# Altium project BioZ_RevA.PrjPcb
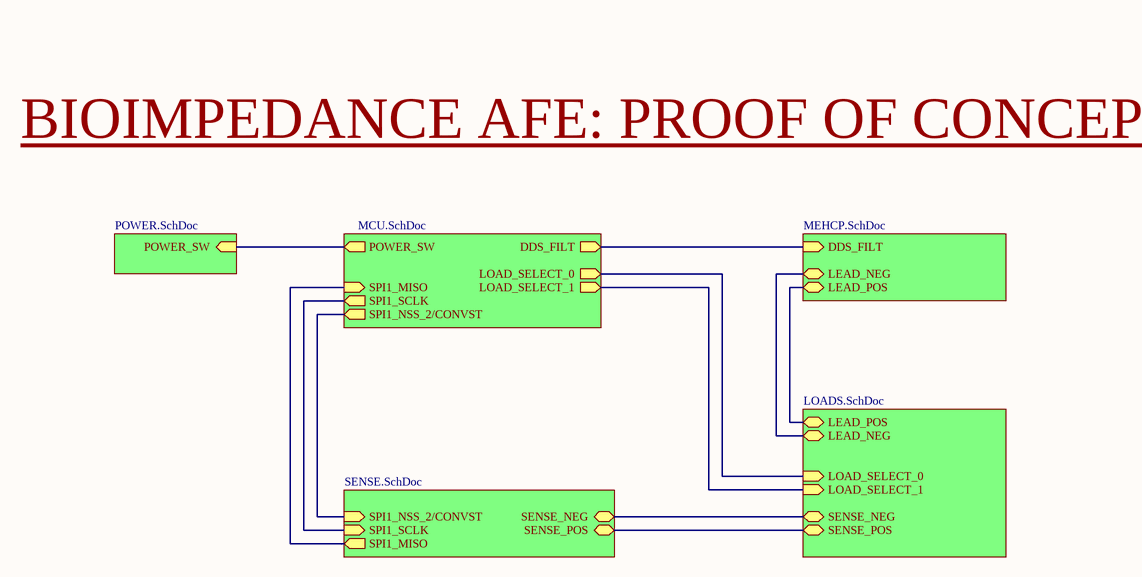
[diagram p0: BLOCK DIAGRAM.SchDoc]
6 sheets, 174 parts. Net scope: hierarchical (ports join the sheet entries above them; power ports are global).
Board file: BioZ.PcbDoc
Sheets:
  BLOCK DIAGRAM.SchDoc
    U_LOADS = LOADS.SchDoc
    U_MCU = MCU.SchDoc
    U_MEHCP = MEHCP.SchDoc
    U_POWER = POWER.SchDoc
    U_SENSE = SENSE.SchDoc

## Sheet BLOCK DIAGRAM.SchDoc: BLOCK DIAGRAM
size A4; DrawnBy: Lucas Church; DocumentNumber: N/A; Revision: A; SheetNumber: 1; SheetTotal: 6

### Sub-sheets
U_LOADS = LOADS.SchDoc: LOAD_SELECT_1 (in), LOAD_SELECT_0 (in), SENSE_NEG (bidir), SENSE_POS (bidir), LEAD_NEG (bidir), LEAD_POS (bidir)
U_MCU = MCU.SchDoc: SPI1_SCLK (out), SPI1_MISO (in), LOAD_SELECT_1 (out), LOAD_SELECT_0 (out), SPI1_NSS_2/CONVST (out), DDS_FILT (out), POWER_SW (out)
U_MEHCP = MEHCP.SchDoc: DDS_FILT (in), LEAD_NEG (bidir), LEAD_POS (bidir)
U_POWER = POWER.SchDoc: POWER_SW (in)
U_SENSE = SENSE.SchDoc: SPI1_SCLK (in), SPI1_NSS_2/CONVST (in), SPI1_MISO (out), SENSE_NEG (bidir), SENSE_POS (bidir)

### Nets
SPI1_SCK: sheet U_MCU/SPI1_SCLK, sheet U_SENSE/SPI1_SCLK
NetC17_2: sheet U_LOADS/LEAD_NEG, sheet U_MEHCP/LEAD_NEG
NetC18_2: sheet U_LOADS/LEAD_POS, sheet U_MEHCP/LEAD_POS
NetD2_1: sheet U_LOADS/SENSE_POS, sheet U_SENSE/SENSE_POS
NetD2_2: sheet U_LOADS/SENSE_NEG, sheet U_SENSE/SENSE_NEG
NetJP5_1: sheet U_LOADS/LOAD_SELECT_0, sheet U_MCU/LOAD_SELECT_0
NetJP7_1: sheet U_LOADS/LOAD_SELECT_1, sheet U_MCU/LOAD_SELECT_1
NetR5_2: sheet U_MCU/DDS_FILT, sheet U_MEHCP/DDS_FILT
NetR44_2: sheet U_MCU/POWER_SW, sheet U_POWER/POWER_SW
NetU1_26: sheet U_MCU/SPI1_NSS_2/CONVST, sheet U_SENSE/SPI1_NSS_2/CONVST
NetU1_28: sheet U_MCU/SPI1_MISO, sheet U_SENSE/SPI1_MISO

### Notes on the sheet
- BIOIMPEDANCE AFE: PROOF OF CONCEPT

## Sheet LOADS.SchDoc
size A4; SheetNumber: 4; SheetTotal: 6
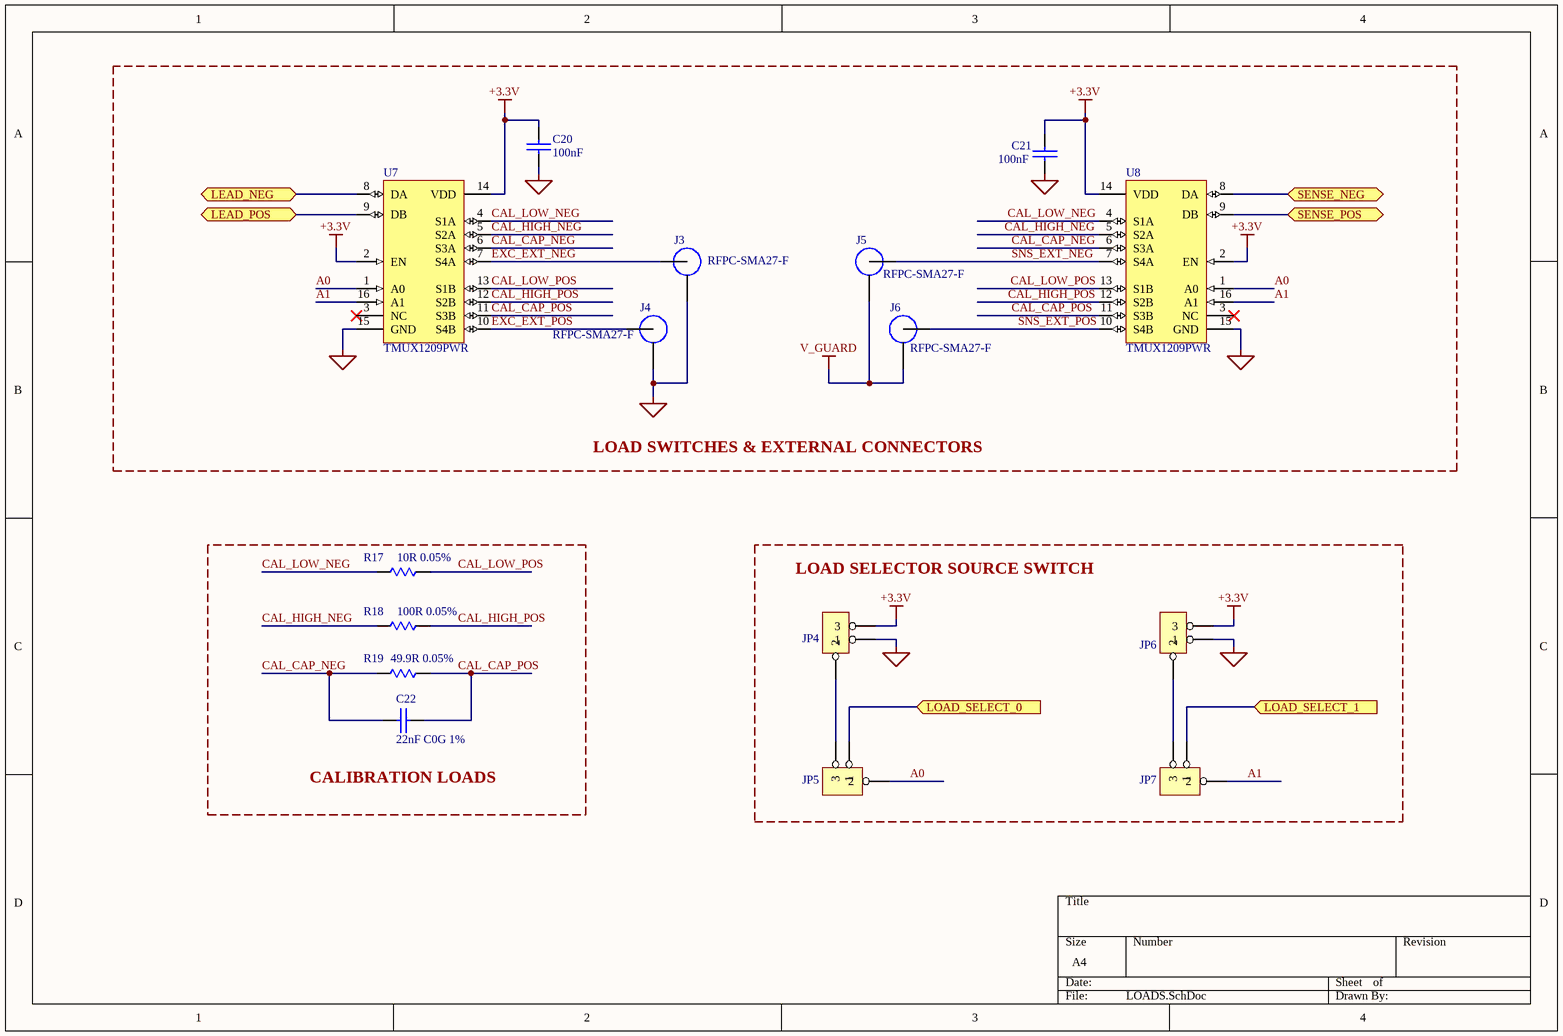
[diagram p1: LOADS.SchDoc]

### Parts
C20  100nF  [0603-CAP]
C21  100nF  [0603-CAP]
C22  22nF C0G 1%  [0805-CAP]
J3  RFPC-SMA27-F  [GRADCONN_RFPC-SMA27-F]
J4  RFPC-SMA27-F  [GRADCONN_RFPC-SMA27-F]
J5  RFPC-SMA27-F  [GRADCONN_RFPC-SMA27-F]
J6  RFPC-SMA27-F  [GRADCONN_RFPC-SMA27-F]
JP4  JUMPER1X3  [JUMPER3]  (value not drawn)
JP5  JUMPER1X3  [JUMPER3]  (value not drawn)
JP6  JUMPER1X3  [JUMPER3]  (value not drawn)
JP7  JUMPER1X3  [JUMPER3]  (value not drawn)
R17  10R 0.05%  [0603-RES]
R18  100R 0.05%  [0603-RES]
R19  49.9R 0.05%  [0603-RES]
U7  TMUX1209PWR  [PW0016A_N]
U8  TMUX1209PWR  [PW0016A_N]

### Blocks framed on the sheet
LOAD SWITCHES & EXTERNAL CONNECTORS: C20 C21 J3-J6 U7 U8
CALIBRATION LOADS: C22 R17-R19
LOAD SELECTOR SOURCE SWITCH: JP4-JP7

### Ports
LEAD_NEG (bidir, see BLOCK DIAGRAM[3C], MEHCP[4B]), LEAD_POS (bidir, see BLOCK DIAGRAM[3C], MEHCP[4C]), LOAD_SELECT_0 (in, see BLOCK DIAGRAM[3C], MCU[3A]), LOAD_SELECT_1 (in, see BLOCK DIAGRAM[3C], MCU[3A]), SENSE_NEG (bidir, see BLOCK DIAGRAM[3C], SENSE[1B]), SENSE_POS (bidir, see BLOCK DIAGRAM[3C], SENSE[1B])

### Nets
+3.3V: C20.1 C21.1 JP4.3 JP6.3 U7.2(EN) U7.14(VDD) U8.2(EN) U8.14(VDD)
GND: C20.2 C21.2 J3.SHLD J4.SHLD JP4.1 JP6.1 U7.15(GND) U8.15(GND)
V_GUARD: J5.SHLD J6.SHLD
A0: JP5.2 U7.1(A0) U8.1(A0)
A1: JP7.2 U7.16(A1) U8.16(A1)
CAL_CAP_NEG: C22.1 R19.1 U7.6(S3A) U8.6(S3A)
CAL_CAP_POS: C22.2 R19.2 U7.11(S3B) U8.11(S3B)
CAL_HIGH_NEG: R18.1 U7.5(S2A) U8.5(S2A)
CAL_HIGH_POS: R18.2 U7.12(S2B) U8.12(S2B)
CAL_LOW_NEG: R17.1 U7.4(S1A) U8.4(S1A)
CAL_LOW_POS: R17.2 U7.13(S1B) U8.13(S1B)
EXC_EXT_NEG: J3.SIG U7.7(S4A)
EXC_EXT_POS: J4.SIG U7.10(S4B)
SNS_EXT_NEG: J5.SIG U8.7(S4A)
SNS_EXT_POS: J6.SIG U8.10(S4B)
NetC17_2: U7.8(DA) ; port LEAD_NEG
NetC18_2: U7.9(DB) ; port LEAD_POS
NetD2_1: U8.9(DB) ; port SENSE_POS
NetD2_2: U8.8(DA) ; port SENSE_NEG
NetJP4_2: JP4.2 JP5.3
NetJP5_1: JP5.1 ; port LOAD_SELECT_0
NetJP6_2: JP6.2 JP7.3
NetJP7_1: JP7.1 ; port LOAD_SELECT_1

Not connected (* = marked no-connect by the designer): U7 3(NC)*; U8 3(NC)*

### Library data of the parts
C20 C21 = CGA3E2C0G1H472J080AA: CAP CER 100 NF 50V X7R 0603; Manufacturer Part Number 1: CC0603KRX7R9BB104; Manufacturer 1: YAGEO; Tech#: SMT; Detailed Description: CAP CER 100 NF 50V X7R 0603; Supplier 1: DigiKey; Supplier Part Number 1: 311-1344-1-ND; Supplier 2: Mouser; Supplier Part Number 2: 810-CGA3E2C0G1H472J; Price(100): 0.1434; Price(250): 0.10756
C22 = GCM21B5C1H223JA16L: CAP CER 0.022UF 50V C0G/NP0 0805; Manufacturer Part Number 1: GCM21B5C1H223FA16L; Manufacturer 1: Murata; Tech#: SMT; Detailed Description: CAP CER 0.022UF 50V C0G/NP0 0805; Supplier 1: DigiKey; Supplier Part Number 1: 490-GCM21B5C1H223FA16LCT-ND; Supplier 2: Mouser; Supplier Part Number 2: 81-GCM21B5C1H223JA6L; Price(100): 0.1789
J3-J6 = RFPC-SMA27-F: MF: {'manufacturer': u'GCT (Gradconn)'}; Package: None; Price: None; Value: *; MP: RFPC-SMA27-F; Availability: Unavailable
JP4-JP7 = 68001-203HLF: CONN HEADER VERT 36POS 2.54MM; Manufacturer 1: FCI; Detailed Description: Jumper, 1x3 Vertical T/H 0.1in; Location: #N/A; Notes: Can be 68001-236HLF cut to length; Tech#: T/H; Manufacturer Part Number 1: 68001-203HLF; Supplier 1: DigiKey; Supplier Part Number 1: 609-3470-ND; Supplier 2: Mouser; Supplier Part Number 2: 649-68001-203HLF; Price(1): 0.43; Price(10): 0.32; Price(25): 0.32; Price(100): 0.2436
R17 = 4.99K 0603: RES SMD 10OHM 0.05% 1/10W 0603; Manufacturer Part Number 1: RNCF0603AKT10R0; Manufacturer 1: Stackpole Electronics; Tech#: SMT; Detailed Description: RES SMD 10OHM 0.05% 1/10W 0603; Supplier 1: DigiKey; Supplier Part Number 1: RNCF0603AKT10R0CT-ND; Supplier 2: Mouser; Supplier Part Number 2: 754-RR0816P-4991D68H; Price(100): 0.023
R18 = 4.99K 0603: RES SMD 100OHM 0.05% 1/10W 0603; Manufacturer Part Number 1: RG1608N-101-W-T1; Manufacturer 1: Susumu; Tech#: SMT; Detailed Description: RES SMD 100OHM 0.05% 1/10W 0603; Supplier 1: DigiKey; Supplier Part Number 1: RG16N100WCT-ND; Supplier 2: Mouser; Supplier Part Number 2: 754-RR0816P-4991D68H; Price(100): 0.023
R19 = 4.99K 0603: RES SMD 49.9OHM 0.05% 1/10W 0603; Manufacturer Part Number 1: RG1608N-49R9-W-T1; Manufacturer 1: Susumu; Detailed Description: RES SMD 49.9OHM 0.1% 1/10W 0603; Tech#: SMT; Supplier 1: DigiKey; Supplier Part Number 1: 408-RG1608N-49R9-W-T1CT-ND; Supplier 2: Mouser; Supplier Part Number 2: 754-RR0816P-4991D68H; Price(100): 0.023
U7 U8 = TMUX1209PWR: 5-V, 4:1, 2-channel general-purpose multiplexer with 1.8-V input logic control 16-TSSOP -40 to 125; Manufacturer_Name: Texas Instruments; TYPE: TYPE; RefDes: RefDes; Copyright: Copyright (C) 2025 Ultra Librarian. All rights reserved.; Manufacturer_Part_Number: TMUX1209PWR

## Sheet MCU.SchDoc
size A4; SheetNumber: 2; SheetTotal: 6
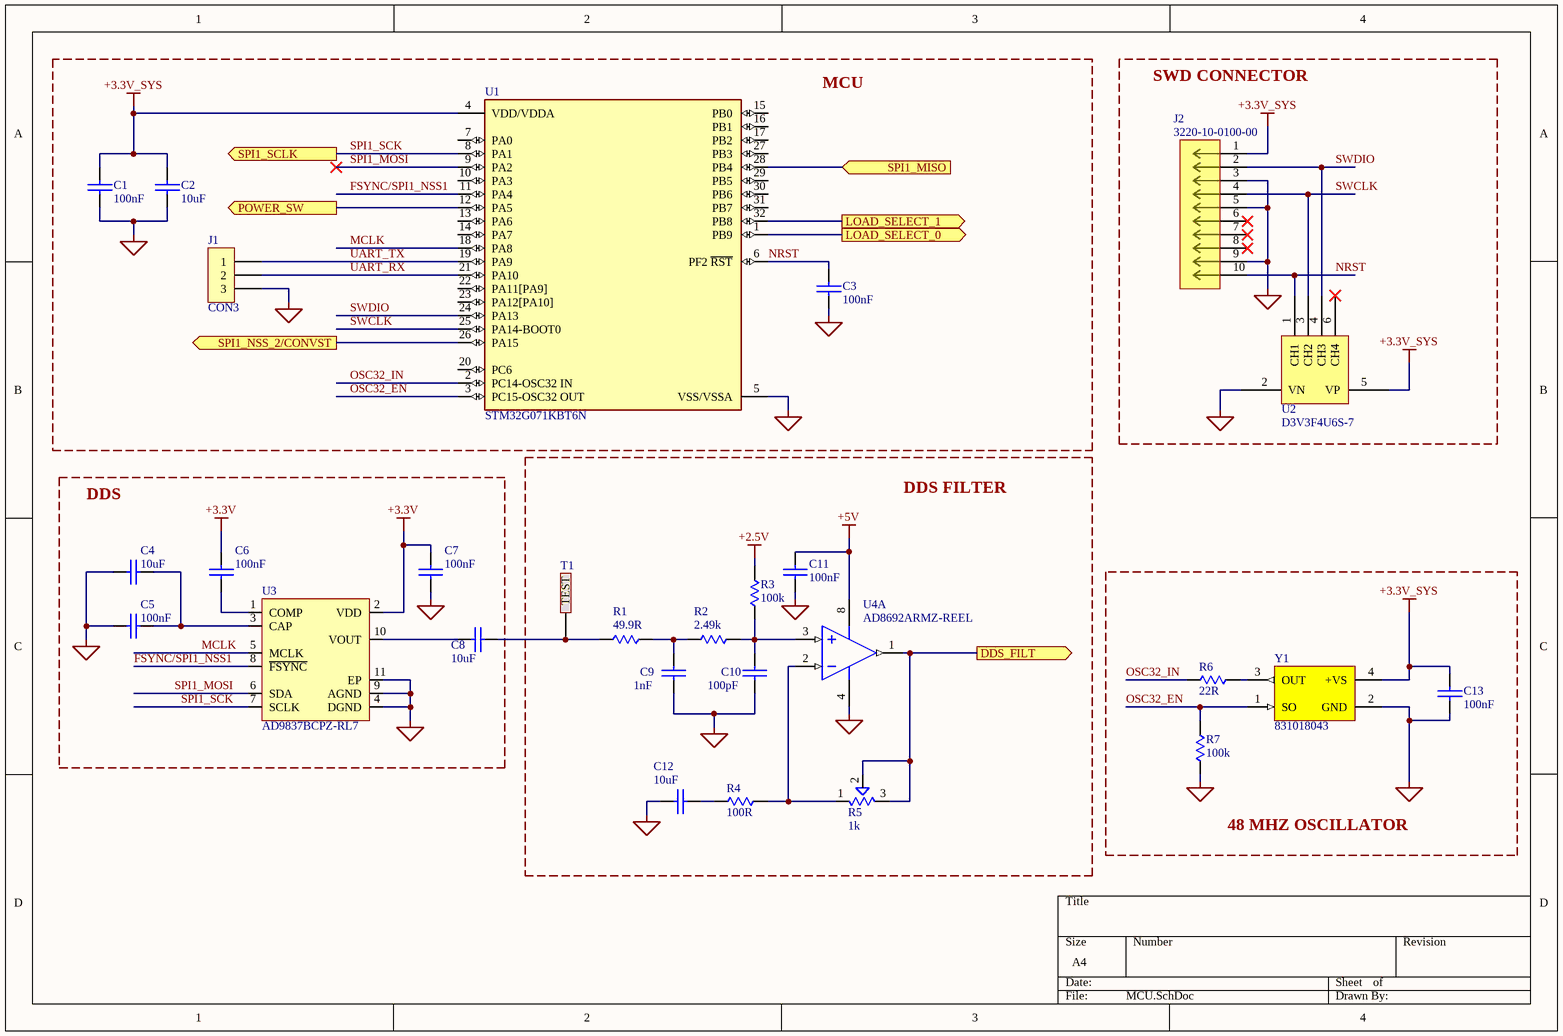
[diagram p2: MCU.SchDoc]

### Parts
C1  100nF  [0603-CAP]
C2  10uF  [0603-CAP]
C3  100nF  [0603-CAP]
C4  10uF  [0603-CAP]
C5  100nF  [0603-CAP]
C6  100nF  [0603-CAP]
C7  100nF  [0603-CAP]
C8  10uF  [0603-CAP]
C9  1nF  [0603-CAP]
C10  100pF  [0603-CAP]
C11  100nF  [0603-CAP]
C12  10uF  [0603-CAP]
C13  100nF  [0603-CAP]
J1  CON3  [SIP3]
J2  3220-10-0100-00  [CONN_3220-10-0100-00_CNC]
R1  49.9R  [0603-RES]
R2  2.49k  [0603-RES]
R3  100k  [0603-RES]
R4  100R  [0603-RES]
R5  1k  [TRIM_PVG5A102C03R00]
R6  22R  [0603-RES]
R7  100k  [0603-RES]
T1  5002K  [TESTPOINT White]  (value not drawn)
U1  STM32G071KBT6N  [FP-LQFP32-5V-IPC_C]
U2  D3V3F4U6S-7  [SOT-363_DIO]
U3  AD9837BCPZ-RL7  [LFCSP-WD (3x3) - 10 Pin EPAD]
U4  AD8692ARMZ-REEL  [ADI-RM-8_M]  (part A of 2)
Y1  831018043  [WE-SPXO_CFPS-73]

### Blocks framed on the sheet
MCU: C1-C3 J1 U1
SWD CONNECTOR: J2 U2
DDS FILTER: C9-C12 R1-R5 T1 U4
DDS: C4-C8 U3
48 MHZ OSCILLATOR: C13 R6 R7 Y1

### Ports
DDS_FILT (out, see BLOCK DIAGRAM[2B], MEHCP[1A]), LOAD_SELECT_0 (out, see BLOCK DIAGRAM[2B], LOADS[3C]), LOAD_SELECT_1 (out, see BLOCK DIAGRAM[2B], LOADS[4C]), POWER_SW (out, see BLOCK DIAGRAM[2B], POWER[3C]), SPI1_MISO (in, see BLOCK DIAGRAM[2B], SENSE[3D]), SPI1_NSS_2/CONVST (out, see BLOCK DIAGRAM[2B], SENSE[3D]), SPI1_SCLK (out, see BLOCK DIAGRAM[2B], SENSE[3D])

### Nets
+2.5V: R3.2
+3.3V: C6.1 C7.1 U3.2(VDD)
+3.3V_SYS: C1.2 C2.1 C13.2 J2.1 U1.4(VDD/VDDA) U2.5(VP) Y1.4(+VS)
+5V: C11.1 U4.8(+V)
GND: C1.1 C2.2 C3.1 C4.2 C5.2 C7.2 C9.2 C10.2 C11.2 C12.2 C13.1 J1.3 J2.3 J2.5 J2.9 R7.1 U1.5(VSS/VSSA) U2.2(VN) U3.4(DGND) U3.9(AGND) U3.11(EP) U4.4(-V) Y1.2(GND)
FSYNC/SPI1_NSS1: U1.11(PA4) U3.8(~{FSYNC})
MCLK: U1.18(PA8) U3.5(MCLK)
NRST: C3.2 J2.10 U1.6(PF2_~{RST}) U2.1(CH1)
OSC32_EN: R7.2 U1.3(PC15-OSC32_OUT) Y1.1(SO)
OSC32_IN: R6.1 U1.2(PC14-OSC32_IN)
SPI1_MOSI: U1.9(PA2) U3.6(SDA)
SPI1_SCK: U1.8(PA1) U3.7(SCLK) ; port SPI1_SCLK
SWCLK: J2.4 U1.25(PA14-BOOT0) U2.3(CH2)
SWDIO: J2.2 U1.24(PA13) U2.4(CH3)
UART_RX: J1.2 U1.21(PA10)
UART_TX: J1.1 U1.19(PA9)
NetC4_1: C4.1 C5.1 U3.3(CAP)
NetC6_2: C6.2 U3.1(COMP)
NetC8_1: C8.1 R1.1 T1.1(TEST)
NetC8_2: C8.2 U3.10(VOUT)
NetC9_1: C9.1 R1.2 R2.1
NetC10_1: C10.1 R2.2 R3.1 U4.3(+IN_A)
NetC12_1: C12.1 R4.1
NetJP5_1: U1.1(PB9) ; port LOAD_SELECT_0
NetJP7_1: U1.32(PB8) ; port LOAD_SELECT_1
NetR4_2: R4.2 R5.1 U4.2(-IN_A)
NetR5_2: R5.2 R5.3 U4.1(OUT_A) ; port DDS_FILT
NetR6_2: R6.2 Y1.3(OUT)
NetR44_2: U1.12(PA5) ; port POWER_SW
NetU1_26: U1.26(PA15) ; port SPI1_NSS_2/CONVST
NetU1_28: U1.28(PB4) ; port SPI1_MISO

Not connected (* = marked no-connect by the designer): J2 6* 7* 8*; U1 7(PA0) 10(PA3) 13(PA6) 14(PA7) 15(PB0) 16(PB1) 17(PB2) 20(PC6) 22(PA11[PA9]) 23(PA12[PA10]) 27(PB3) 29(PB5) 30(PB6) 31(PB7); U2 6(CH4)*

### Library data of the parts
C1 C3 C5-C7 C11 C13 = CGA3E2C0G1H472J080AA: as C20 on sheet LOADS; Detailed Description: CAP CER 100 NF 50V X7R 0603; Supplier 1: DigiKey; Supplier Part Number 1: 311-1344-1-ND; Supplier 2: Mouser; Supplier Part Number 2: 810-CGA3E2C0G1H472J; Price(100): 0.1434; Price(250): 0.10756
C2 C4 C8 C12 = CGA3E2C0G1H472J080AA: CAP CER 10uF 6.3V X5R 0603; Manufacturer Part Number 1: GRM188R60J106KE47D; Manufacturer 1: Murata Electronics; Detailed Description: CAP CER 100 NF 50V X7R 0603; Tech#: SMT; Supplier 1: DigiKey; Supplier Part Number 1: 490-12538-1-ND; Supplier 2: Mouser; Supplier Part Number 2: 810-CGA3E2C0G1H472J; Price(100): 0.1434; Price(250): 0.10756
C9 = CGA3E2C0G1H472J080AA: CAP CER 1000 PF 50V C0G 0603; Manufacturer Part Number 1: GRM1885C1H102JA01D; Manufacturer 1: Murata; Detailed Description: CAP CER 100 NF 50V X7R 0603; Tech#: SMT; Supplier 1: DigiKey; Supplier Part Number 1: 490-1451-1-ND; Supplier 2: Mouser; Supplier Part Number 2: 810-CGA3E2C0G1H472J; Price(100): 0.1434; Price(250): 0.10756
C10 = CGA3E2C0G1H472J080AA: CAP CER 100 PF 50V C0G 0603; Manufacturer Part Number 1: CC0603JRNPO9BN101; Manufacturer 1: YAGEO; Tech#: SMT; Detailed Description: CAP CER 100 PF 50V C0G 0603; Supplier 1: DigiKey; Supplier Part Number 1: 311-1069-1-ND; Supplier 2: Mouser; Supplier Part Number 2: 810-CGA3E2C0G1H472J; Price(100): 0.1434; Price(250): 0.10756
J1 = CON3: Connector
J2 = 3220-10-0100-00: Description; Manufacturer_Name: CNC Tech; Copyright: Copyright (C) 2025 Ultra Librarian. All rights reserved.; Manufacturer_Part_Number: 3220-10-0100-00; RefDes: RefDes; Type: Type
R1 = 4.99K 0603: RES SMD 49.9OHM 0.1% 1/10W 0603; Manufacturer Part Number 1: RT0603BRD0749R9L; Manufacturer 1: Yageo; Tech#: SMT; Detailed Description: RES SMD 49.9OHM 0.1% 1/10W 0603; Supplier 1: DigiKey; Supplier Part Number 1: YAG1672CT-ND; Supplier 2: Mouser; Supplier Part Number 2: 754-RR0816P-4991D68H; Price(100): 0.023
R2 = 4.99K 0603: RES SMD 2.49kOHM 0.1% 1/10W 0603; Manufacturer Part Number 1: ERA-3AEB2491V; Manufacturer 1: Panasonic; Tech#: SMT; Detailed Description: RES SMD 2.49kOHM 0.1% 1/10W 0603; Supplier 1: DigiKey; Supplier Part Number 1: RES SMD 2.49KOHM 0.1% 1/10W 0603; Supplier 2: Mouser; Supplier Part Number 2: 754-RR0816P-4991D68H; Price(100): 0.023
R3 R7 = 4.99K 0603: RES SMD 100KOHM 0.1% 1/10W 0603; Manufacturer Part Number 1: RT0603BRD07100KL; Manufacturer 1: YAGEO; Detailed Description: RES SMD 4.99KOHM 0.5% 1/16W 0603; Tech#: SMT; Supplier 1: DigiKey; Supplier Part Number 1: YAG1235CT-ND; Supplier 2: Mouser; Supplier Part Number 2: 754-RR0816P-4991D68H; Price(100): 0.023
R4 = 4.99K 0603: RES SMD 100OHM 0.1% 1/10W 0603; Manufacturer Part Number 1: RG1608P-101-B-T5; Manufacturer 1: Susumu; Detailed Description: RES SMD 4.99KOHM 0.5% 1/16W 0603; Tech#: SMT; Supplier 1: DigiKey; Supplier Part Number 1: RR08P4.99KDCT-ND; Supplier 2: Mouser; Supplier Part Number 2: 754-RR0816P-4991D68H; Price(100): 0.023
R5 = PVG5A102C03R00: TRIMMER-SMD 4MM SQ MT CERMET Square / 12 turn / Sealed | Bourns PVG5A102C03R00; SnapEDA_Link: https://www.snapeda.com/parts/PVG5A102C03R00/Bourns/view-part/?ref=snap; Package: SMD-3 Bourns; Value: *; MF: Bourns; MP: PVG5A102C03R00; Check_prices: https://www.snapeda.com/parts/PVG5A102C03R00/Bourns/view-part/?ref=eda
R6 = 4.99K 0603: RES SMD 22OHM 0.1% 1/10W 0603; Manufacturer Part Number 1: RT0603BRD0722RL; Manufacturer 1: YAGEO; Tech#: SMT; Detailed Description: RES SMD 22OHM 0.1% 1/10W 0603; Supplier 1: DigiKey; Supplier Part Number 1: 13-RT0603BRD0722RLCT-ND; Supplier 2: Mouser; Supplier Part Number 2: 754-RR0816P-4991D68H; Price(100): 0.023
T1 = 5002K: PC TEST POINT MINIATURE WHITE; Manufacturer 1: Keystone Electronics; Detailed Description: Connector, TestPoint White; Location: F1-33; Tech#: T/H; Manufacturer Part Number 1: 5002K; Supplier 1: DigiKey; Supplier Part Number 1: 36-5002-ND; Supplier 2: Mouser; Supplier Part Number 2: 534-5002; Price(1): 0.56; Price(10): 0.506; Price(100): 0.3541
U1 = CMP-12105-000115-1: IC MCU 32BIT 128KB FLASH 32LQFP; Core Architecture: ARM; Frequency: 64MHz; Number of I/Os: 30; Interface: I2C; Oscillator Type: Internal; Peripherals: Brown-out Detect/Reset; Number of Pins: 32; Max Operating Temperature: 85°C; RoHS Compliant: Yes; Packaging: Cut Tape; Case/Package: LQFP; Memory Type: FLASH; Memory Size: 128KB; Min Operating Temperature: -40°C
U2 = D3V3F4U6S-7: Description; Manufacturer_Name: Diodes Inc; Copyright: Copyright (C) 2025 Ultra Librarian. All rights reserved.; Manufacturer_Part_Number: D3V3F4U6S-7; RefDes: RefDes; Type: Type
U3 = AD9837BCPZ-RL7: Direct Digital Synthesis IC 10 b 16 MHz 28 b Tuning 10-LFCSP-WD (3x3)
U4 = CMP-0384-01747-1: Double Channel Wide Bandwidth Operational Amplifier, 10 MHz BW, 5 V/us SR, Industrial, 8-pin SOP (RM-8), Reel; Manufacturer: Analog Devices; Generic Part Number: AD8692; Slew Rate: 5V/us; Automotive Qualified: Yes; V Span Max: 6V; V Span Min: 2.7V; Input Bias Current: 200fA; Amplifiers Per Package: 2; Iq/Amp: 1.05mA; Input Offset Voltage: 400uV; Small Signal Bandwidth: 10MHz; ComponentLink1Description: Manufacturer URL; ComponentLink1URL: http://www.analog.com/en/index.html; Mounting Technology: Surface Mount; PackageDescription: 8-Pin Mini Small Outline Package, Body 3 x 3 mm, Pitch 0.65 mm; PackageReference: RM-8; DatasheetVersion: Rev. E; PartNumber: AD8692ARMZ-REEL; ComponentLink2Description: Datasheet; ComponentLink3Description: Package Specification; ComponentLink2URL: http://www.analog.com/static/imported-files/data_sheets/AD8691_8692_8694.pdf; ComponentLink3URL: http://www.analog.com/static/imported-files/packages/PKG_PDF/MSOP%28RM%29/RM_8.pdf; Code_JEDEC: MO-187-AA
Y1 = WE-SPXO_CFPS-73: MF: {'manufacturer': u'W\xfcrth Elektronik'}; Package: None; Price: None; Value: *; MP: 831018043; Availability: Unavailable

## Sheet MEHCP.SchDoc
size A4; SheetNumber: 3; SheetTotal: 6
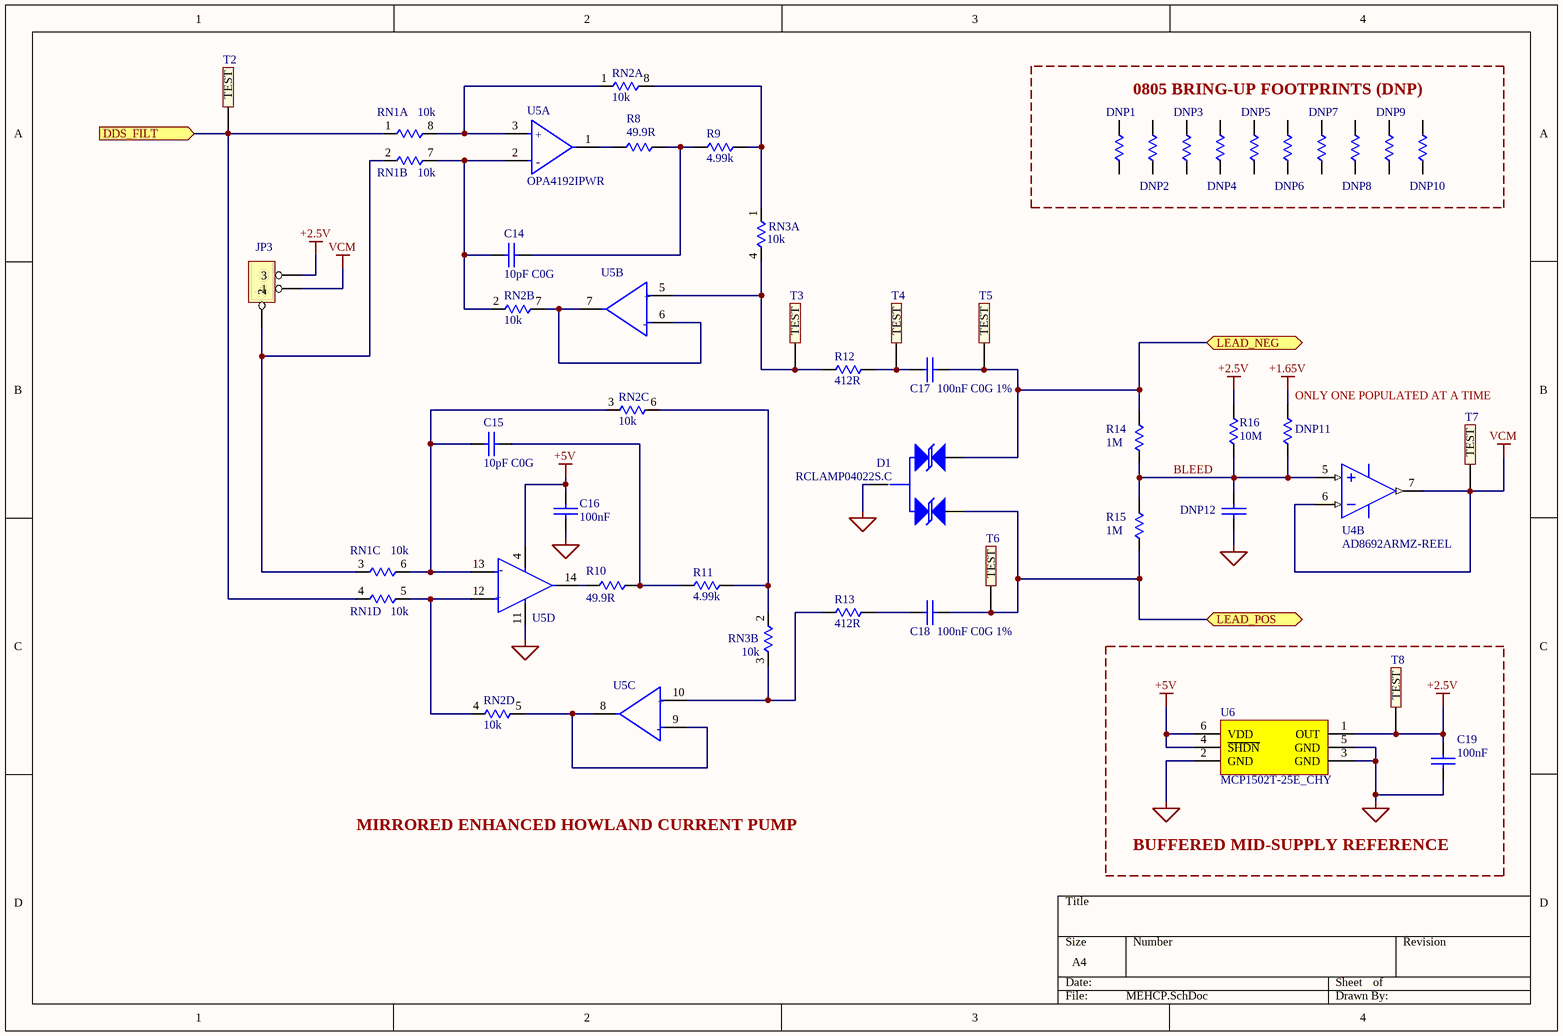
[diagram p3: MEHCP.SchDoc]

### Parts
C14  10pF C0G  [0603-CAP]
C15  10pF C0G  [0603-CAP]
C16  100nF  [0603-CAP]
C17  100nF C0G 1%  [1206-CAP]
C18  100nF C0G 1%  [1206-CAP]
C19  100nF  [0603-CAP]
D1  RCLAMP04022S.C  [SOT-23 3L]
DNP1  240R 0.1%  [0805-RES]  (value not drawn)  (no BOM)
DNP2  240R 0.1%  [0805-RES]  (value not drawn)  (no BOM)
DNP3  240R 0.1%  [0805-RES]  (value not drawn)  (no BOM)
DNP4  240R 0.1%  [0805-RES]  (value not drawn)  (no BOM)
DNP5  240R 0.1%  [0805-RES]  (value not drawn)  (no BOM)
DNP6  240R 0.1%  [0805-RES]  (value not drawn)  (no BOM)
DNP7  240R 0.1%  [0805-RES]  (value not drawn)  (no BOM)
DNP8  240R 0.1%  [0805-RES]  (value not drawn)  (no BOM)
DNP9  240R 0.1%  [0805-RES]  (value not drawn)  (no BOM)
DNP10  240R 0.1%  [0805-RES]  (value not drawn)  (no BOM)
DNP11  10M  [0603-RES]  (value not drawn)  (no BOM)
DNP12  4.7nF C0G  [0603-CAP]  (value not drawn)  (no BOM)
JP3  JUMPER1X3  [JUMPER3]  (value not drawn)
R8  49.9R  [0603-RES]
R9  4.99k  [0603-RES]
R10  49.9R  [0603-RES]
R11  4.99k  [0603-RES]
R12  412R  [0603-RES]
R13  412R  [0603-RES]
R14  1M  [0603-RES]
R15  1M  [0603-RES]
R16  10M  [0603-RES]
RN1  10k  [1206 4-Resistor Network]  (parts A,B,C,D of 4)
RN2  10k  [1206 4-Resistor Network]  (parts A,B,C,D of 4)
RN3  10k  [0606 2-RESISTOR NETWORK]  (parts A,B of 2)
T2  5002K  [TESTPOINT White]  (value not drawn)
T3  5002K  [TESTPOINT White]  (value not drawn)
T4  5002K  [TESTPOINT White]  (value not drawn)
T5  5002K  [TESTPOINT White]  (value not drawn)
T6  5002K  [TESTPOINT White]  (value not drawn)
T7  5002K  [TESTPOINT White]  (value not drawn)
T8  5002K  [TESTPOINT White]  (value not drawn)
U4  AD8692ARMZ-REEL  [ADI-RM-8_M]  (part B of 2)
U5  OPA4192IPWR  [FP-PW0014A-IPC_C]  (parts A,B,C,D of 4)
U6  MCP1502T-25E_CHY  [SOT95P280X145-6N]

### Blocks framed on the sheet
0805 BRING-UP FOOTPRINTS (DNP): DNP1-DNP10
BUFFERED MID-SUPPLY REFERENCE: C19 T8 U6

### Ports
DDS_FILT (in, see BLOCK DIAGRAM[3B], MCU[3C]), LEAD_NEG (bidir, see BLOCK DIAGRAM[3B], LOADS[1A]), LEAD_POS (bidir, see BLOCK DIAGRAM[3B], LOADS[1A])

### Nets
+1.65V: DNP11.2
+2.5V: C19.1 JP3.3 R16.2 T8.1(TEST) U6.1(OUT)
+5V: C16.1 U5.4(V+) U6.4(~{SHDN}) U6.6(VDD)
GND: C16.2 C19.2 D1.3 DNP12.1 U5.11(V-) U6.2(GND) U6.3(GND) U6.5(GND)
VCM: JP3.1 T7.1(TEST) U4.6(-IN_B) U4.7(OUT_B)
BLEED: DNP11.1 DNP12.2 R14.1 R15.2 R16.1 U4.5(+IN_B)
NetC14_1: C14.1 RN1.7 RN2.2 U5.2(-IN_A)
NetC14_2: C14.2 R8.2 R9.1
NetC15_1: C15.1 RN1.6 RN2.3 U5.13(-IN_D)
NetC15_2: C15.2 R10.2 R11.1
NetC17_1: C17.1 R12.2 T4.1(TEST)
NetC17_2: C17.2 D1.2 R14.2 T5.1(TEST) ; port LEAD_NEG
NetC18_1: C18.1 R13.2
NetC18_2: C18.2 D1.1 R15.1 T6.1(TEST) ; port LEAD_POS
NetJP3_2: JP3.2 RN1.2 RN1.3
NetR5_2: RN1.1 RN1.4 T2.1(TEST) ; port DDS_FILT
NetR8_1: R8.1 U5.1(OUT_A)
NetR9_2: R9.2 RN2.8 RN3.1
NetR10_1: R10.1 U5.14(OUT_D)
NetR11_2: R11.2 RN2.6 RN3.2
NetR12_1: R12.1 RN3.4 T3.1(TEST) U5.5(+IN_B)
NetR13_1: R13.1 RN3.3 U5.10(+IN_C)
NetRN1_5: RN1.5 RN2.4 U5.12(+IN_D)
NetRN1_8: RN1.8 RN2.1 U5.3(+IN_A)
NetRN2_5: RN2.5 U5.8(OUT_C) U5.9(-IN_C)
NetRN2_7: RN2.7 U5.6(-IN_A) U5.7(OUT_B)

Not connected (* = marked no-connect by the designer): DNP1 1 2; DNP2 1 2; DNP3 1 2; DNP4 1 2; DNP5 1 2; DNP6 1 2; DNP7 1 2; DNP8 1 2; DNP9 1 2; DNP10 1 2

### Notes on the sheet
- (near DNP11) ONLY ONE POPULATED AT A TIME
- MIRRORED ENHANCED HOWLAND CURRENT PUMP
- (in symbol CMP-04895-000439-1, part A) +; -
- (in symbol CMP-04895-000439-1, part B) +; -
- (in symbol CMP-04895-000439-1, part C) +; -
- (in symbol CMP-04895-000439-1, part D) -; +

### Library data of the parts
C14 C15 = CGA3E2C0G1H472J080AA: CAP CER 10PF 50V C0G 0603; Manufacturer Part Number 1: CC0603JRNPO9BN100; Manufacturer 1: Murata; Tech#: SMT; Detailed Description: CAP CER 10PF 50V C0G 0603; Supplier 1: DigiKey; Supplier Part Number 1: 311-1058-1-ND; Supplier 2: Mouser; Supplier Part Number 2: 810-CGA3E2C0G1H472J; Price(100): 0.1434; Price(250): 0.10756
C16 C19 = CGA3E2C0G1H472J080AA: as C20 on sheet LOADS; Detailed Description: CAP CER 100 NF 50V X7R 0603; Supplier 1: DigiKey; Supplier Part Number 1: 311-1344-1-ND; Supplier 2: Mouser; Supplier Part Number 2: 810-CGA3E2C0G1H472J; Price(100): 0.1434; Price(250): 0.10756
C17 C18 = GRM31C5C1H104JA01L: CAP CER 0.1UF 1% 50V C0G/NP0 1206; Manufacturer Part Number 1: GRT31C5C1H104FA02L; Manufacturer 1: Murata; Tech#: SMT; Detailed Description: CAP CER 0.1UF 1% 50V C0G/NP0 1206; Supplier 1: DigiKey; Supplier Part Number 1: 490-GRT31C5C1H104FA02LCT-ND; Supplier 2: Mouser; Supplier Part Number 2: 81-GRM31C5C1H104JA1L; Price(100): 0.2317
DNP1-DNP10 = 240R 0.1%: RES SMD 240 OHM 0.1% 1/8W 0805; Manufacturer Part Number 1: RG2012P-241-B-T5; Manufacturer 1: Susumu; Tech#: SMT; Detailed Description: RES SMD 240 OHM 0.1% 1/8W 0805; Supplier 1: Mouser; Supplier Part Number 1: 754-RG2012P-241-BT5; Supplier 2: DigiKey; Supplier Part Number 2: RG20P240BCT-ND; Price(100): 0.149
DNP11 R16 = 4.99K 0603: RES SMD 10MOHM 1% 1/10W 0603; Manufacturer Part Number 1: RC0603FR-0710ML; Manufacturer 1: YAGEO; Tech#: SMT; Detailed Description: RES SMD 10MOHM 1% 1/10W 0603; Supplier 1: DigiKey; Supplier Part Number 1: 311-10.0MHRCT-ND; Supplier 2: Mouser; Supplier Part Number 2: 754-RR0816P-4991D68H; Price(100): 0.023
DNP12 = CGA3E2C0G1H472J080AA: CAP CER 4700PF 50V C0G 0603; Manufacturer Part Number 1: GRM1885C1H472JA01D; Manufacturer 1: Murata; Tech#: SMT; Detailed Description: CAP CER 4700PF 50V C0G 0603; Supplier 1: DigiKey; Supplier Part Number 1: 490-9669-1-ND; Supplier 2: Mouser; Supplier Part Number 2: 810-CGA3E2C0G1H472J; Price(100): 0.1434; Price(250): 0.10756
JP3 = 68001-203HLF: as JP4 on sheet LOADS; Manufacturer Part Number 1: 68001-203HLF; Supplier 1: DigiKey; Supplier Part Number 1: 609-3470-ND; Supplier 2: Mouser; Supplier Part Number 2: 649-68001-203HLF; Price(1): 0.43; Price(10): 0.32; Price(25): 0.32; Price(100): 0.2436
R8 R10 = 4.99K 0603: as R1 on sheet MCU; Detailed Description: RES SMD 49.9OHM 0.1% 1/10W 0603; Supplier 1: DigiKey; Supplier Part Number 1: YAG1672CT-ND; Supplier 2: Mouser; Supplier Part Number 2: 754-RR0816P-4991D68H; Price(100): 0.023
R9 R11 = 4.99K 0603: RES SMD 4.99KOHM 0.1% 1/10W 0603; Manufacturer Part Number 1: RG1608P-4991-B-T5; Manufacturer 1: Susumu; Tech#: SMT; Detailed Description: RES SMD 4.99KOHM 0.1% 1/10W 0603; Supplier 1: DigiKey; Supplier Part Number 1: RG16P4.99KBCT-ND; Supplier 2: Mouser; Supplier Part Number 2: 754-RR0816P-4991D68H; Price(100): 0.023
R12 R13 = 4.99K 0603: RES SMD 412OHM 0.1% 1/10W 0603; Manufacturer Part Number 1: RT0603BRD07412RL; Manufacturer 1: YAGEO; Tech#: SMT; Detailed Description: RES SMD 412OHM 0.1% 1/10W 0603; Supplier 1: DigiKey; Supplier Part Number 1: YAG1659CT-ND; Supplier 2: Mouser; Supplier Part Number 2: 754-RR0816P-4991D68H; Price(100): 0.023
R14 R15 = 4.99K 0603: RES SMD 1MOHM 0.1% 1/10W 0603; Manufacturer Part Number 1: RT0603BRD071ML; Manufacturer 1: YAGEO; Detailed Description: RES SMD 1OHM 0.1% 1/10W 0603; Tech#: SMT; Supplier 1: DigiKey; Supplier Part Number 1: YAG4498CT-ND; Supplier 2: Mouser; Supplier Part Number 2: 754-RR0816P-4991D68H; Price(100): 0.023
RN1 RN2 = ACASA1002S1002P1AT: 4 resistor, resistor network in a 8 pin DIP package
RN3 = ACASN1002S1002P1AT: 2 resistor, resistor network, 10k/10k 0.1% abs. and 0.05% rel., 0606, 25ppm
T2-T8 = 5002K: as T1 on sheet MCU; Manufacturer Part Number 1: 5002K; Supplier 1: DigiKey; Supplier Part Number 1: 36-5002-ND; Supplier 2: Mouser; Supplier Part Number 2: 534-5002; Price(1): 0.56; Price(10): 0.506; Price(100): 0.3541
U4 = CMP-0384-01747-1: as U4 on sheet MCU; ComponentLink1Description: Manufacturer URL; ComponentLink1URL: http://www.analog.com/en/index.html; Mounting Technology: Surface Mount; PackageDescription: 8-Pin Mini Small Outline Package, Body 3 x 3 mm, Pitch 0.65 mm; PackageReference: RM-8; DatasheetVersion: Rev. E; PartNumber: AD8692ARMZ-REEL; ComponentLink2Description: Datasheet; ComponentLink3Description: Package Specification; ComponentLink2URL: http://www.analog.com/static/imported-files/data_sheets/AD8691_8692_8694.pdf; ComponentLink3URL: http://www.analog.com/static/imported-files/packages/PKG_PDF/MSOP%28RM%29/RM_8.pdf; Code_JEDEC: MO-187-AA
U5 = CMP-04895-000439-1: IC OPAMP GP 4 CIRCUIT 14TSSOP; Gain Bandwidth Product: 10MHz; Number of Channels: 4; Case/Package: TSSOP; Lead Free: Lead Free; Max Operating Temperature: 125°C; RoHS Compliant: Yes; Min Operating Temperature: -40°C
U6 = MCP1502T-25E_CHY: Series Voltage Reference IC Fixed 2.5V V +/-0.1% 20 mA SOT-23-6; Manufacturer_Name: Microchip; Manufacturer_Part_Number: MCP1502T-25E/CHY; Geometry.Height: 1.45mm; Mouser Part Number: 579-MCP1502T-25E/CHY; Mouser Price/Stock: https://www.mouser.co.uk/ProductDetail/Microchip-Technology/MCP1502T-25E-CHY?qs=W%2FMpXkg%252BdQ4EOhKykk%2F7dw%3D%3D; Datasheet Link: *

## Sheet POWER.SchDoc
size A4; SheetNumber: 6; SheetTotal: 6
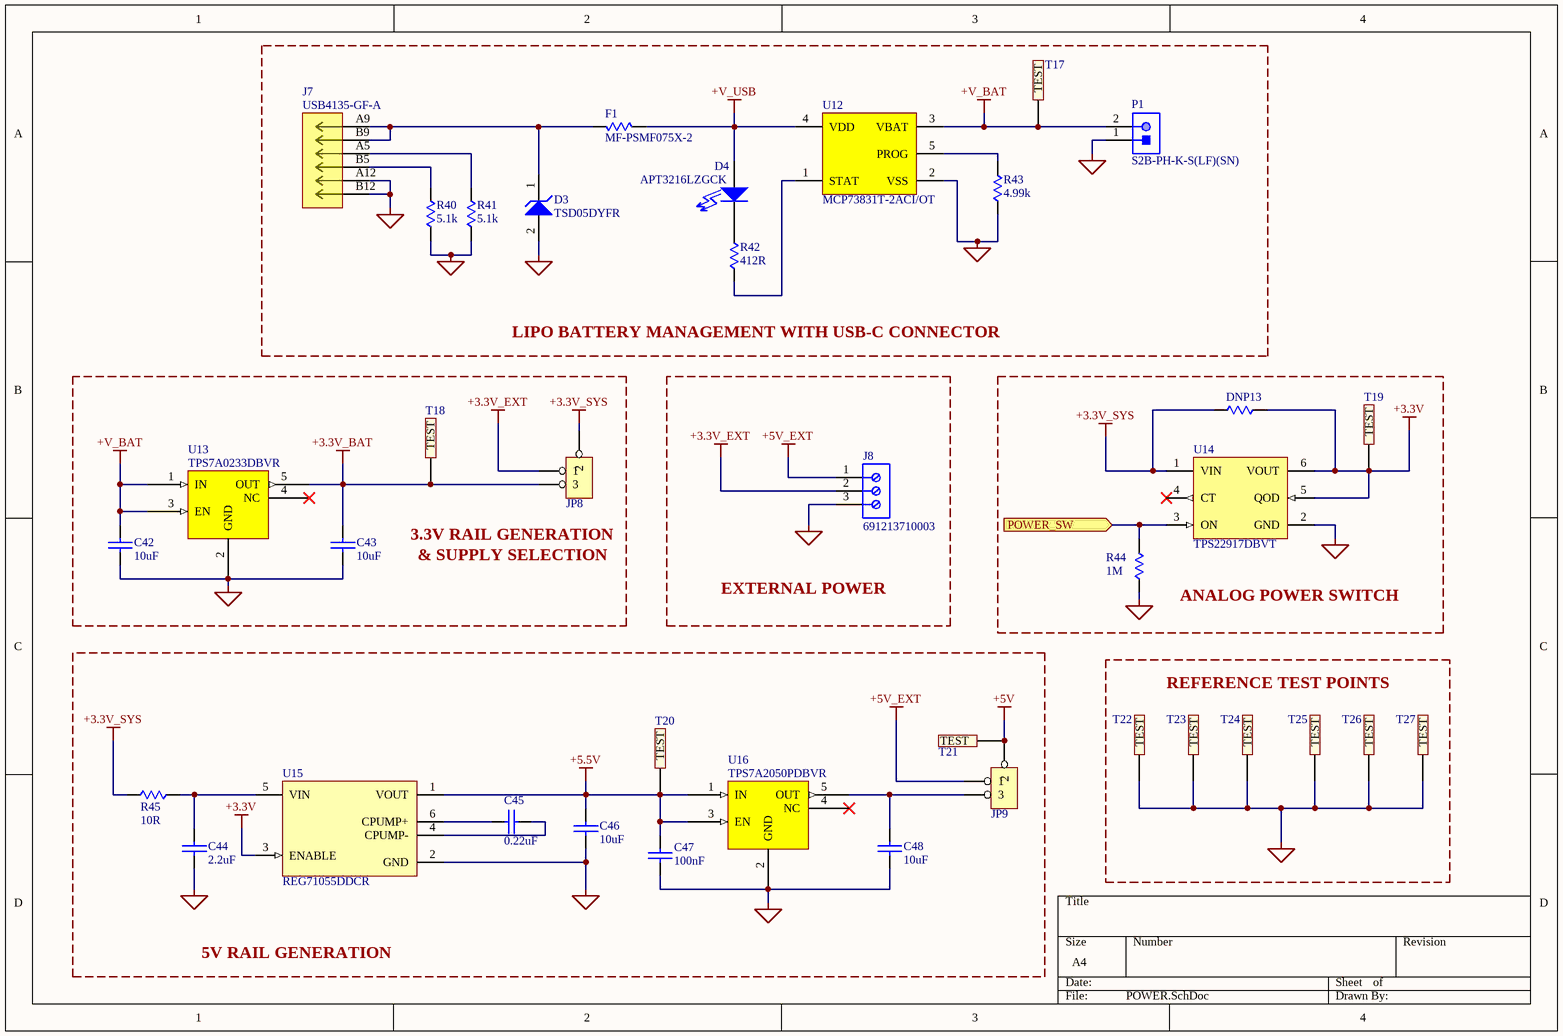
[diagram p4: POWER.SchDoc]

### Parts
C42  10uF  [0603-CAP]
C43  10uF  [0603-CAP]
C44  2.2uF  [0603-CAP]
C45  0.22uF  [0603-CAP]
C46  10uF  [0603-CAP]
C47  100nF  [0603-CAP]
C48  10uF  [0603-CAP]
D3  TSD05DYFR  [TVS_SOD2_DYF_TEX-L]
D4  APT3216LZGCK  [1206-LED]
DNP13  DNP  [0603-RES]  (value not drawn)  (no BOM)
F1  MF-PSMF075X-2  [0805-RES]
J7  USB4135-GF-A  [CONN_USB4135-GF-A_GCT]
J8  691213710003  [691213710003]
JP8  JUMPER1X3  [JUMPER3]  (value not drawn)
JP9  JUMPER1X3  [JUMPER3]  (value not drawn)
P1  S2B-PH-K-S(LF)(SN)  [JST-S2B-PH-K-S_V]
R40  5.1k  [0603-RES]
R41  5.1k  [0603-RES]
R42  412R  [0603-RES]
R43  4.99k  [0603-RES]
R44  1M  [0603-RES]
R45  10R  [0603-RES]
T17  5002K  [TESTPOINT White]  (value not drawn)
T18  5002K  [TESTPOINT White]  (value not drawn)
T19  5002K  [TESTPOINT White]  (value not drawn)
T20  5002K  [TESTPOINT White]  (value not drawn)
T21  5002K  [TESTPOINT White]  (value not drawn)
T22  5011K  [TESTPOINT Black]  (value not drawn)
T23  5011K  [TESTPOINT Black]  (value not drawn)
T24  5011K  [TESTPOINT Black]  (value not drawn)
T25  5011K  [TESTPOINT Black]  (value not drawn)
T26  5011K  [TESTPOINT Black]  (value not drawn)
T27  5011K  [TESTPOINT Black]  (value not drawn)
U12  MCP73831T-2ACI/OT  [SOT23_DBV_TEX-M]
U13  TPS7A0233DBVR  [SOT23_DBV_TEX-M]
U14  TPS22917DBVT  [DBV0006_N]
U15  REG71055DDCR  [DDC0006A_M]
U16  TPS7A2050PDBVR  [SOT23_DBV_TEX-M]

### Blocks framed on the sheet
LIPO BATTERY MANAGEMENT WITH USB-C CONNECTOR: D3 D4 F1 J7 P1 R40-R43 T17 U12
EXTERNAL POWER: J8
ANALOG POWER SWITCH: DNP13 R44 T19 U14
5V RAIL GENERATION: C44-C48 JP9 R45 T20 T21 U15 U16
REFERENCE TEST POINTS: T22-T27

### Ports
POWER_SW (in, see BLOCK DIAGRAM[2B], MCU[1A])

### Nets
+3.3V: DNP13.2 T19.1(TEST) U14.5(QOD) U14.6(VOUT) U15.3(ENABLE)
+3.3V_BAT: C43.1 JP8.3 T18.1(TEST) U13.5(OUT)
+3.3V_EXT: J8.2 JP8.1
+3.3V_SYS: DNP13.1 JP8.2 R45.1 U14.1(VIN)
+5.5V: C46.1 C47.1 T20.1(TEST) U15.1(VOUT) U16.1(IN) U16.3(EN)
+5V: JP9.2 T21.1(TEST)
+5V_EXT: J8.1 JP9.1
+V_BAT: C42.1 P1.2 T17.1(TEST) U12.3(VBAT) U13.1(IN) U13.3(EN)
+V_USB: D4.1 F1.2 U12.4(VDD)
GND: C42.2 C43.2 C44.1 C46.2 C47.2 C48.2 D3.2(A) J7.A12(GND) J7.B12(GND) J8.3 P1.1 R40.2 R41.2 R43.1 R44.1 T22.1(TEST) T23.1(TEST) T24.1(TEST) T25.1(TEST) T26.1(TEST) T27.1(TEST) U12.2(VSS) U13.2(GND) U14.2(GND) U15.2(GND) U16.2(GND)
NetC44_2: C44.2 R45.2 U15.5(VIN)
NetC45_1: C45.1 U15.6(CPUMP+)
NetC45_2: C45.2 U15.4(CPUMP-)
NetC48_1: C48.1 JP9.3 U16.5(OUT)
NetD3_1: D3.1(K) F1.1 J7.A9(VBUS) J7.B9(VBUS)
NetD4_2: D4.2 R42.2
NetJ7_A5: J7.A5(CC1) R41.1
NetJ7_B5: J7.B5(CC2) R40.1
NetR42_1: R42.1 U12.1(STAT)
NetR43_2: R43.2 U12.5(PROG)
NetR44_2: R44.2 U14.3(ON) ; port POWER_SW

Not connected (* = marked no-connect by the designer): U13 4(NC)*; U14 4(CT)*; U16 4(NC)*

### Notes on the sheet
- (near JP8) 3.3V RAIL GENERATION
- & SUPPLY SELECTION

### Library data of the parts
C42 C43 C46 C48 = CGA3E2C0G1H472J080AA: as C2 on sheet MCU; Supplier 1: DigiKey; Supplier Part Number 1: 490-12538-1-ND; Supplier 2: Mouser; Supplier Part Number 2: 810-CGA3E2C0G1H472J; Price(100): 0.1434; Price(250): 0.10756
C44 = CGA3E2C0G1H472J080AA: CAP CER 2.2UF 35V X5R 0603; Manufacturer Part Number 1: GRM188R6YA225MA12D; Manufacturer 1: Murata Electronics; Tech#: SMT; Detailed Description: CAP CER 2.2UF 35V X5R 0603; Supplier 1: DigiKey; Supplier Part Number 1: 490-10486-1-ND; Supplier 2: Mouser; Supplier Part Number 2: 810-CGA3E2C0G1H472J; Price(100): 0.1434; Price(250): 0.10756
C45 = CGA3E2C0G1H472J080AA: CAP CER 0.22UF 25V X7R 0603; Manufacturer Part Number 1: GRM188R71E224KA88D; Manufacturer 1: Murata Electronics; Tech#: SMT; Detailed Description: CAP CER 0.22UF 25V X7R 0603; Supplier 1: DigiKey; Supplier Part Number 1: 490-3290-1-ND; Supplier 2: Mouser; Supplier Part Number 2: 810-CGA3E2C0G1H472J; Price(100): 0.1434; Price(250): 0.10756
C47 = CGA3E2C0G1H472J080AA: as C20 on sheet LOADS; Detailed Description: CAP CER 100 NF 50V X7R 0603; Supplier 1: DigiKey; Supplier Part Number 1: 311-1344-1-ND; Supplier 2: Mouser; Supplier Part Number 2: 810-CGA3E2C0G1H472J; Price(100): 0.1434; Price(250): 0.10756
D3 = TSD05DYFR: 5-V 60-A Unidirectional surge protection device 2-SOT -40 to 125; Manufacturer_Name: Texas Instruments; Copyright: Copyright (C) 2026 Ultra Librarian. All rights reserved.; Manufacturer_Part_Number: TSD05DYFR; RefDes: RefDes; Type: Type
D4 = APT3216LZGCK: LED GREEN CLEAR 2SMD; Manufacturer 1: Kingbright; Detailed Description: LED, Green SMT1206 2.65V 2mA 50mcd; Location: #N/A; Tech#: SMT; Spec: 2.65V 2mA 50mcd; Manufacturer Part Number 1: APT3216LZGCK; Supplier 1: DigiKey; Supplier Part Number 1: 754-1944-1-ND; Supplier 2: Mouser; Supplier Part Number 2: 604-APT3216LZGCK; Price(1): 0.94; Price(10): 0.725; Price(25): 0.6076; Price(100): 0.5233; Colour: Green
DNP13 R40 R41 = 4.99K 0603: RES SMD 5.1K OHM 0.1% 1/10W 0603; Manufacturer Part Number 1: RG1608P-512-B-T5; Manufacturer 1: Susumu; Tech#: SMT; Detailed Description: RES SMD 5.1K OHM 0.1% 1/10W 0603; Supplier 1: DigiKey; Supplier Part Number 1: RG16P5.1KBCT-ND; Supplier 2: Mouser; Supplier Part Number 2: 754-RR0816P-4991D68H; Price(100): 0.023
F1 = 240R 0.1%: PTC RESET FUSE 6V 750MA 0805; Manufacturer 1: Bourns; Tech#: SMT; Manufacturer Part Number 1: MF-PSMF075X-2; Detailed Description: PTC RESET FUSE 6V 750MA 0805; Supplier 1: Digikey; Supplier Part Number 1: MF-PSMF075X-2CT-ND; Supplier 2: DigiKey; Supplier Part Number 2: RG20P240BCT-ND; Price(100): 0.149
J7 = USB4135-GF-A: Description; Manufacturer_Name: Global Connector Technology; Copyright: Copyright (C) 2026 Ultra Librarian. All rights reserved.; Manufacturer_Part_Number: USB4135-GF-A; RefDes: RefDes; Type: Type
J8 = CMP-1502-02527-3: 213 Series 5MM Pitch Straight, Pcb Terminal Block, Through Hole, 3 Way; Stripping Length: -7mm; Wire Gauge (Max): 26AWG; Pitch: 5.0038mm; Voltage: 300V; Current: 10A; Wire/Cable Gauge: 16AWG; Connector Type: PCB, Terminal Block; Plating: Brass, Steel; Number of Positions Per Level: 3; Number of Levels: 1; Height: 10mm; Housing Material: Nylon; Termination: Screw; RoHS: Compliant; Max Operating Temperature: 105°C; Contact Plating: Tin; Contact Material: Brass; Number of Pins: 3; Color: Green; Length: 8.3mm; REACH SVHC: Unknown; Packaging: Box; Wire Gauge (Min): 16AWG; Min Operating Temperature: -40°C; Lead Pitch: 5mm; Number of Contacts: 3; Width: 15.6mm; Mount: Through Hole
JP8 JP9 = 68001-203HLF: as JP4 on sheet LOADS; Manufacturer Part Number 1: 68001-203HLF; Supplier 1: DigiKey; Supplier Part Number 1: 609-3470-ND; Supplier 2: Mouser; Supplier Part Number 2: 649-68001-203HLF; Price(1): 0.43; Price(10): 0.32; Price(25): 0.32; Price(100): 0.2436
P1 = CMP-1755-00004-1: Male Header, Pitch 2 mm, 1 x 2 Position, Height 4.8 mm, Tail Length 3.4 mm, -25 to 85 degC, RoHS, Bulk; Case\Package: Radial; Tolerance: 20%; Capacitance: 10 uF; Voltage Rating (DC): 50 V; Packaging: Bulk; ComponentLink1URL: http://www.jst-mfg.com/product/pdf/eng/ePH.pdf; Radiation Hardening: No; Height: 11 mm; Package Quantity: 200; PackageDescription: Male Header, Pitch 2 mm, 1 x 2 Position, Height 4.8 mm, Tail Length 3.4 mm; PackageReference: S2B-PH-K-S; Diameter: 5 mm; Pins: 2; Mount: Through Hole; Max Operating Temperature: 85 degC; Min Operating Temperature: -40 degC; ComponentLink1Description: Datasheet; DatasheetVersion: Dec-12; Length: 11 mm; Lead Pitch: 2 mm; REACH SVHC: No SVHC; Voltage Rating: 50 V; RoHSCompliant: true
R42 = 4.99K 0603: as R12 on sheet MEHCP; Detailed Description: RES SMD 412OHM 0.1% 1/10W 0603; Supplier 1: DigiKey; Supplier Part Number 1: YAG1659CT-ND; Supplier 2: Mouser; Supplier Part Number 2: 754-RR0816P-4991D68H; Price(100): 0.023
R43 = 4.99K 0603: as R9 on sheet MEHCP; Detailed Description: RES SMD 4.99KOHM 0.1% 1/10W 0603; Supplier 1: DigiKey; Supplier Part Number 1: RG16P4.99KBCT-ND; Supplier 2: Mouser; Supplier Part Number 2: 754-RR0816P-4991D68H; Price(100): 0.023
R44 = 4.99K 0603: as R14 on sheet MEHCP; Supplier 1: DigiKey; Supplier Part Number 1: YAG4498CT-ND; Supplier 2: Mouser; Supplier Part Number 2: 754-RR0816P-4991D68H; Price(100): 0.023
R45 = 4.99K 0603: as R17 on sheet LOADS; Detailed Description: RES SMD 10OHM 0.05% 1/10W 0603; Supplier 1: DigiKey; Supplier Part Number 1: RNCF0603AKT10R0CT-ND; Supplier 2: Mouser; Supplier Part Number 2: 754-RR0816P-4991D68H; Price(100): 0.023
T17-T21 = 5002K: as T1 on sheet MCU; Manufacturer Part Number 1: 5002K; Supplier 1: DigiKey; Supplier Part Number 1: 36-5002-ND; Supplier 2: Mouser; Supplier Part Number 2: 534-5002; Price(1): 0.56; Price(10): 0.506; Price(100): 0.3541
T22-T27 = 5011K: PC TEST POINT MULTIPURPOSE BLACK; Manufacturer 1: Keystone Electronics; Detailed Description: Connector, TestPoint Black; Location: F1-34; Tech#: T/H; Manufacturer Part Number 1: 5011K; Supplier 1: DigiKey; Supplier Part Number 1: 36-5011-ND; Supplier 2: Mouser; Supplier Part Number 2: 534-5011; Price(1): 0.57; Price(10): 0.506; Price(100): 0.3541
U12 = CMP-0133-00143-2: IC CONTROLLR LI-ION 4.2V SOT23-5; Max Power Dissipation: 1.54W; Output Current: 500mA; Max Output Voltage: 4.5V; Number of Outputs: 1; Min Output Voltage: 4.168V; Min Supply Voltage: 3.75V; Max Input Voltage: 6V; Voltage Rating: 4.534V; Drain to Source Resistance: 350mR; Max Operating Temperature: 85°C; Length: 0.122inch; Number of Pins: 5; REACH SVHC: No SVHC; Radiation Hardening: No; Min Operating Temperature: -40°C; Weight: 0.00709oz; Contact Plating: Tin; Termination: SMD/SMT; Case/Package: SOT-23; Mount: Surface Mount; Width: 0.071inch; Packaging: Tape and Reel; Number of Cells: 1; Max Charge Current: 500mA; Height: 0.051inch; Number of Channels: 1; Output Voltage: 4.2V; Max Supply Voltage: 6V; Lead Free: Lead Free
U13 U16 = TPS7A0230PDBVR: 200mA, nanopower-IQ (25 nA), low-dropout (LDO) voltage regulator with enable 5-SOT-23 -40 to 125; Manufacturer_Name: Texas Instruments; Copyright: Copyright (C) 2026 Ultra Librarian. All rights reserved.; Manufacturer_Part_Number: TPS7A0230PDBVR; RefDes: RefDes; Type: Type
U14 = TPS22917DBVT: 5.5-V, 2-A, 80-mÎ© , 10-nA leakage load switch adj. rise time and adj output discharge 6-SOT-23 -40 to 125; Manufacturer_Name: Texas Instruments; TYPE: TYPE; RefDes: RefDes; Copyright: Copyright (C) 2026 Ultra Librarian. All rights reserved.; Manufacturer_Part_Number: TPS22917DBVT
U15 = CMP-0391-00039-2: 5.5 V, Buck / Boost Charge Pump, 60 mA, 3 to 5.5 V Input with 2-Cell Alkaline / Nixx Input, -40 to 85 degC, 6-pin SOT23 (DDC6), Green (RoHS & no Sb/Br); Manufacturer: Texas Instruments; Vin(Max)(V): 5.5; Iq(Typ)(mA): 0.065; Efficiency(Typ)(%): 90; Vin(Min)(V): 3; Vout(Min)(V): 5.2; Vout(Max)(V): 5.8; Switching Frequency(Max)(kHz): 1000; Iout(Max)(A): 0.06; 2-Cell Alkaline/Nixx Input: TRUE; Preset Vout(V): 5.5; PartNumber: REG71055DDCR; ComponentLink2URL: http://www.ti.com/general/docs/lit/getliterature.tsp?genericPartNumber=REG71055&fileType=pdf; Code_JEDEC: MO-193; ComponentLink3Description: Package Specification; Eco-Plan: Green (RoHS & no Sb/Br); PackageVersion: 4204403-3/E; Topology: Buck/Boost; ComponentLink1URL: http://www.ti.com/; PackageReference: DDC0006A; PackageDescription: 6-Pin Plastic Small Outline, Body 2.9 x 1.6 mm, 0.95 mm Pitch; ComponentLink3URL: http://www.ti.com/litv/pdf/mpds124d; Mounting Technology: Surface Mount; ComponentLink2Description: Datasheet; DatasheetVersion: SBAS221G; ComponentLink1Description: Manufacturer URL

## Sheet SENSE.SchDoc
size A4; SheetNumber: 5; SheetTotal: 6
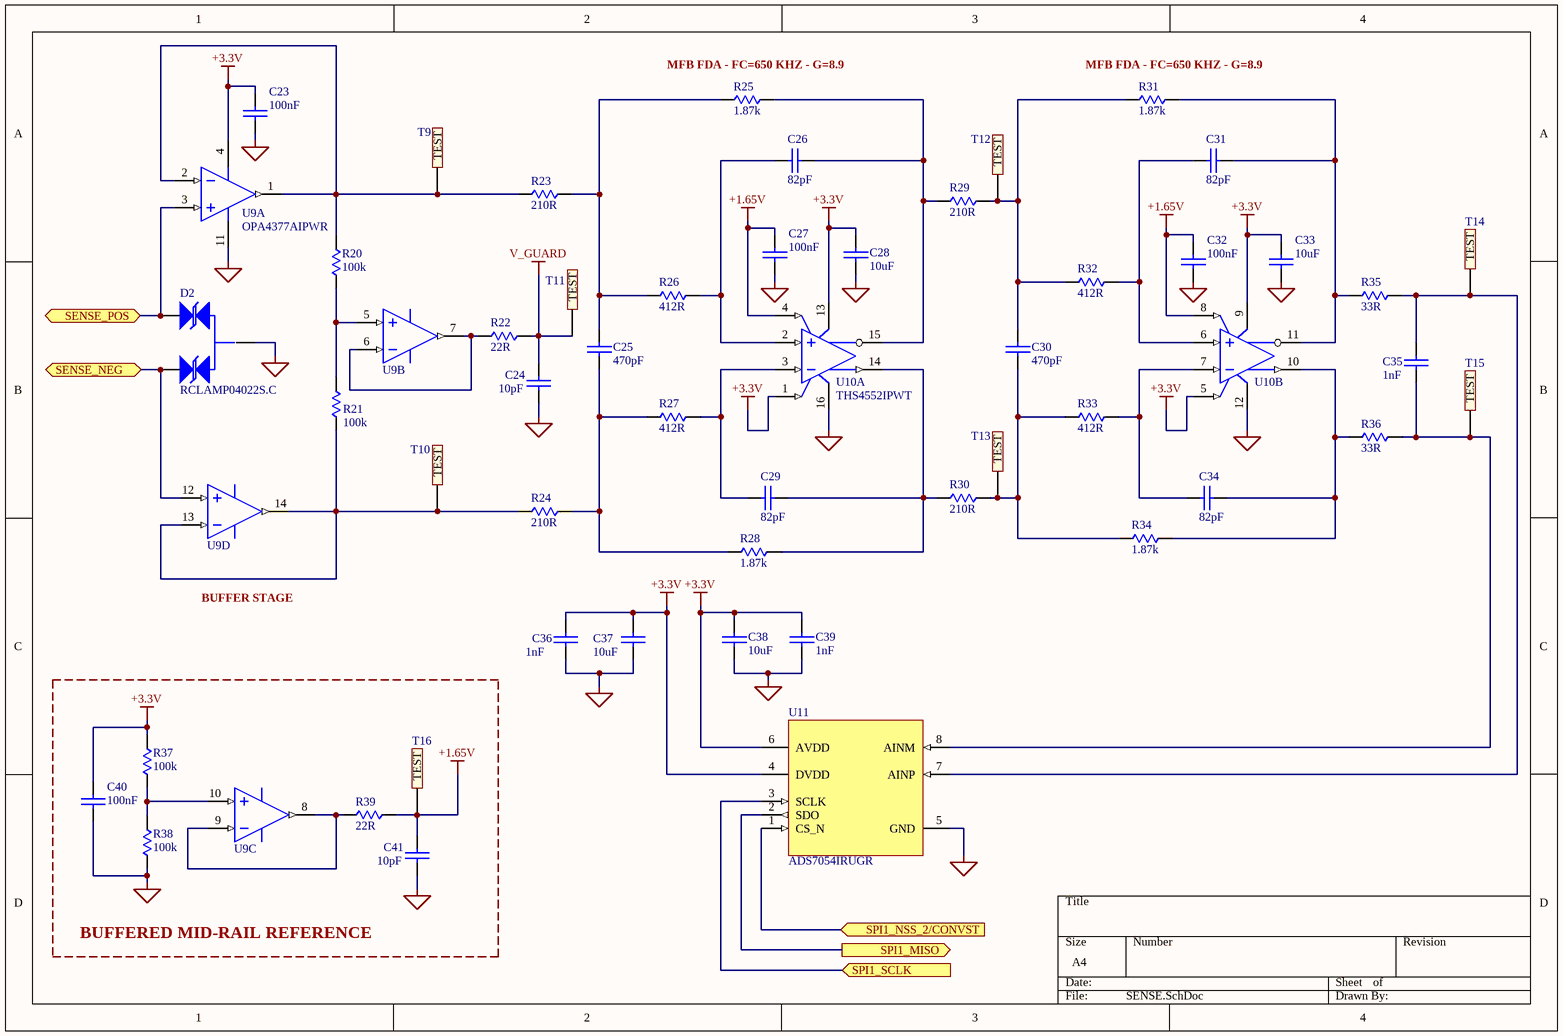
[diagram p5: SENSE.SchDoc]

### Parts
C23  100nF  [0603-CAP]
C24  10pF  [0603-CAP]
C25  470pF  [0603-CAP]
C26  82pF  [0603-CAP]
C27  100nF  [0603-CAP]
C28  10uF  [0603-CAP]
C29  82pF  [0603-CAP]
C30  470pF  [0603-CAP]
C31  82pF  [0603-CAP]
C32  100nF  [0603-CAP]
C33  10uF  [0603-CAP]
C34  82pF  [0603-CAP]
C35  1nF  [0603-CAP]
C36  1nF  [0603-CAP]
C37  10uF  [0603-CAP]
C38  10uF  [0603-CAP]
C39  1nF  [0603-CAP]
C40  100nF  [0603-CAP]
C41  10pF  [0603-CAP]
D2  RCLAMP04022S.C  [SOT-23 3L]
R20  100k  [0603-RES]
R21  100k  [0603-RES]
R22  22R  [0603-RES]
R23  210R  [0603-RES]
R24  210R  [0603-RES]
R25  1.87k  [0603-RES]
R26  412R  [0603-RES]
R27  412R  [0603-RES]
R28  1.87k  [0603-RES]
R29  210R  [0603-RES]
R30  210R  [0603-RES]
R31  1.87k  [0603-RES]
R32  412R  [0603-RES]
R33  412R  [0603-RES]
R34  1.87k  [0603-RES]
R35  33R  [0603-RES]
R36  33R  [0603-RES]
R37  100k  [0603-RES]
R38  100k  [0603-RES]
R39  22R  [0603-RES]
T9  5002K  [TESTPOINT White]  (value not drawn)
T10  5002K  [TESTPOINT White]  (value not drawn)
T11  5002K  [TESTPOINT White]  (value not drawn)
T12  5002K  [TESTPOINT White]  (value not drawn)
T13  5002K  [TESTPOINT White]  (value not drawn)
T14  5002K  [TESTPOINT White]  (value not drawn)
T15  5002K  [TESTPOINT White]  (value not drawn)
T16  5002K  [TESTPOINT White]  (value not drawn)
U9  OPA4377AIPWR  [PW0014A_N]  (parts A,B,C,D of 4)
U10  THS4552IPWT  [PW0016A_N]  (parts A,B of 2)
U11  ADS7054IRUGR  [8-X2QFN (1.5x1.5)]

### Blocks framed on the sheet
BUFFERED MID-RAIL REFERENCE: C40 C41 R37-R39 T16 U9

### Ports
SENSE_NEG (bidir, see BLOCK DIAGRAM[3C], LOADS[4A]), SENSE_POS (bidir, see BLOCK DIAGRAM[3C], LOADS[4A]), SPI1_MISO (out, see BLOCK DIAGRAM[2C], MCU[3A]), SPI1_NSS_2/CONVST (in, see BLOCK DIAGRAM[2C], MCU[1B]), SPI1_SCLK (in, see BLOCK DIAGRAM[2C], MCU[1A])

### Nets
+1.65V: C27.1 C32.1 C41.1 R39.2 T16.1(TEST) U10.4(VOCM1) U10.8(VOCM2)
+3.3V: C23.1 C28.1 C33.1 C36.1 C37.1 C38.1 C39.1 C40.1 R37.2 U9.4(V+) U10.1(PD1_N) U10.5(PD2_N) U10.9(VS2+) U10.13(VS1+) U11.4(DVDD) U11.6(AVDD)
GND: C23.2 C24.2 C27.2 C28.2 C32.2 C33.2 C36.2 C37.2 C38.2 C39.2 C40.2 C41.2 D2.3 R38.1 U9.11(V-) U10.12(VS-) U10.16(VS-) U11.5(GND)
V_GUARD: C24.1 R22.2 T11.1(TEST)
SPI1_SCK: U11.3(SCLK) ; port SPI1_SCLK
NetC25_1: C25.1 R24.2 R27.1 R28.1
NetC25_2: C25.2 R23.2 R25.1 R26.1
NetC26_1: C26.1 R26.2 U10.2(VIN1+)
NetC26_2: C26.2 R25.2 R29.1 U10.15(VOUT1-)
NetC29_1: C29.1 R27.2 U10.3(VIN1-)
NetC29_2: C29.2 R28.2 R30.1 U10.14(VOUT1+)
NetC30_1: C30.1 R30.2 R33.1 R34.1 T13.1(TEST)
NetC30_2: C30.2 R29.2 R31.1 R32.1 T12.1(TEST)
NetC31_1: C31.1 R32.2 U10.6(VIN2+)
NetC31_2: C31.2 R31.2 R35.1 U10.11(VOUT2-)
NetC34_1: C34.1 R33.2 U10.7(VIN2-)
NetC34_2: C34.2 R34.2 R36.1 U10.10(VOUT2+)
NetC35_1: C35.1 R35.2 T14.1(TEST) U11.7(AINP)
NetC35_2: C35.2 R36.2 T15.1(TEST) U11.8(AINM)
NetD2_1: D2.1 U9.3(IN_A+) ; port SENSE_POS
NetD2_2: D2.2 U9.12(IN_D+) ; port SENSE_NEG
NetR20_1: R20.1 R21.2 U9.5(IN_B+)
NetR20_2: R20.2 R23.1 T9.1(TEST) U9.1(OUT_A) U9.2(IN_A-)
NetR21_1: R21.1 R24.1 T10.1(TEST) U9.13(IN_D-) U9.14(OUT_D)
NetR22_1: R22.1 U9.6(IN_B-) U9.7(OUT_B)
NetR37_1: R37.1 R38.2 U9.10(IN_C+)
NetR39_1: R39.1 U9.8(OUT_C) U9.9(IN_C-)
NetU1_26: U11.1(CS_N) ; port SPI1_NSS_2/CONVST
NetU1_28: U11.2(SDO) ; port SPI1_MISO

### Notes on the sheet
- (near R25) MFB FDA - FC=650 KHZ - G=8.9
- (near R31) MFB FDA - FC=650 KHZ - G=8.9
- BUFFER STAGE

### Library data of the parts
C23 C27 C32 C40 = CGA3E2C0G1H472J080AA: as C20 on sheet LOADS; Detailed Description: CAP CER 100 NF 50V X7R 0603; Supplier 1: DigiKey; Supplier Part Number 1: 311-1344-1-ND; Supplier 2: Mouser; Supplier Part Number 2: 810-CGA3E2C0G1H472J; Price(100): 0.1434; Price(250): 0.10756
C24 C41 = CGA3E2C0G1H472J080AA: CAP CER 10PF 50V C0G/NPO 0603; Manufacturer Part Number 1: CC0603JRNPO9BN100; Manufacturer 1: YAGEO; Tech#: SMT; Detailed Description: CAP CER 10PF 50V C0G/NPO 0603; Supplier 1: DigiKey; Supplier Part Number 1: 311-1058-1-ND; Supplier 2: Mouser; Supplier Part Number 2: 810-CGA3E2C0G1H472J; Price(100): 0.1434; Price(250): 0.10756
C25 C30 = CGA3E2C0G1H472J080AA: CAP CER 470PF 50V C0G 0603; Manufacturer Part Number 1: CL10C471JB8NNNC; Manufacturer 1: Samsung; Tech#: SMT; Detailed Description: CAP CER 470PF 50V C0G 0603; Supplier 1: DigiKey; Supplier Part Number 1: 1276-1168-1-ND; Supplier 2: Mouser; Supplier Part Number 2: 810-CGA3E2C0G1H472J; Price(100): 0.1434; Price(250): 0.10756
C26 C29 C31 C34 = CGA3E2C0G1H472J080AA: CAP CER 82PF 50V C0G 0603; Manufacturer Part Number 1: C0603C820J5GACTU; Manufacturer 1: KEMET; Tech#: SMT; Detailed Description: CAP CER 82PF 50V C0G 0603; Supplier 1: DigiKey; Supplier Part Number 1: 399-C0603C820J5GACTUCT-ND; Supplier 2: Mouser; Supplier Part Number 2: 810-CGA3E2C0G1H472J; Price(100): 0.1434; Price(250): 0.10756
C28 C33 C37 C38 = CGA3E2C0G1H472J080AA: as C2 on sheet MCU; Supplier 1: DigiKey; Supplier Part Number 1: 490-12538-1-ND; Supplier 2: Mouser; Supplier Part Number 2: 810-CGA3E2C0G1H472J; Price(100): 0.1434; Price(250): 0.10756
C35 C36 C39 = CGA3E2C0G1H472J080AA: as C9 on sheet MCU; Supplier 1: DigiKey; Supplier Part Number 1: 490-1451-1-ND; Supplier 2: Mouser; Supplier Part Number 2: 810-CGA3E2C0G1H472J; Price(100): 0.1434; Price(250): 0.10756
R20 R21 R37 R38 = 4.99K 0603: as R3 on sheet MCU; Supplier 1: DigiKey; Supplier Part Number 1: YAG1235CT-ND; Supplier 2: Mouser; Supplier Part Number 2: 754-RR0816P-4991D68H; Price(100): 0.023
R22 R39 = 4.99K 0603: as R6 on sheet MCU; Detailed Description: RES SMD 22OHM 0.1% 1/10W 0603; Supplier 1: DigiKey; Supplier Part Number 1: 13-RT0603BRD0722RLCT-ND; Supplier 2: Mouser; Supplier Part Number 2: 754-RR0816P-4991D68H; Price(100): 0.023
R23 R24 R29 R30 = 4.99K 0603: RES SMD 210OHM 0.1% 1/10W 0603; Manufacturer Part Number 1: RT0603BRD07210RL; Manufacturer 1: YAGEO; Tech#: SMT; Detailed Description: RES SMD 210OHM 0.1% 1/10W 0603; Supplier 1: DigiKey; Supplier Part Number 1: YAG4502CT-ND; Supplier 2: Mouser; Supplier Part Number 2: 754-RR0816P-4991D68H; Price(100): 0.023
R25 R28 R31 R34 = 4.99K 0603: RES SMD 1.87KOHM 0.1% 1/10W 0603; Manufacturer Part Number 1: RT0603BRD071K87L; Manufacturer 1: YAGEO; Tech#: SMT; Detailed Description: RES SMD 1.87KOHM 0.1% 1/10W 0603; Supplier 1: DigiKey; Supplier Part Number 1: YAG4497CT-ND; Supplier 2: Mouser; Supplier Part Number 2: 754-RR0816P-4991D68H; Price(100): 0.023
R26 R27 R32 R33 = 4.99K 0603: as R12 on sheet MEHCP; Detailed Description: RES SMD 412OHM 0.1% 1/10W 0603; Supplier 1: DigiKey; Supplier Part Number 1: YAG1659CT-ND; Supplier 2: Mouser; Supplier Part Number 2: 754-RR0816P-4991D68H; Price(100): 0.023
R35 R36 = 4.99K 0603: RES SMD 33OHM 0.1% 1/10W 0603; Manufacturer Part Number 1: RT0603BRD0733RL; Manufacturer 1: YAGEO; Tech#: SMT; Detailed Description: RES SMD 33OHM 0.1% 1/10W 0603; Supplier 1: DigiKey; Supplier Part Number 1: 13-RT0603BRD0733RLCT-ND; Supplier 2: Mouser; Supplier Part Number 2: 754-RR0816P-4991D68H; Price(100): 0.023
T9-T16 = 5002K: as T1 on sheet MCU; Manufacturer Part Number 1: 5002K; Supplier 1: DigiKey; Supplier Part Number 1: 36-5002-ND; Supplier 2: Mouser; Supplier Part Number 2: 534-5002; Price(1): 0.56; Price(10): 0.506; Price(100): 0.3541
U9 = CMP-0272-01748-3: Low-Cost, Low Noise, 5.5 MHz CMOS Operational Amplifier, 2.2 to 5.5 V, -40 to 125 degC, 14-pin SOP (PW14), Green (RoHS & no Sb/Br); Manufacturer: Texas Instruments; Number of Channels: 4; Iq per channel(Max)(mA): 1.05; Vn at 1kHz(Typ)(nV/rtHz): 7.5; Offset Drift(Typ)(uV/C): 0.32; Slew Rate(Typ)(V/us): 2; IIB(Max)(pA): 10; Sub Family: Low Input Bias Current Amp (<=10pA), Low Noise Amp (<=10nV/rtHz), Low Supply Voltage Amplifier (<=2.7V), Precision Amplifier; Total Supply Voltage(Max)(+5V is 5, +/-5V is 10): 5.5; Vio (25C)(Max)(mV): 1; CMRR(Min)(dB): 70; Total Supply Voltage(Min)(+5V is 5, +/-5V is 10): 2.2; Code_JEDEC: MO-153; ComponentLink3URL: http://www.ti.com/litv/pdf/mpds360; PackageReference: PW0014A; PackageDescription: 14-Pin Plastic Small Outline, Body 5 x 4.4 mm, Pitch 0.65 mm; ComponentLink1URL: http://www.ti.com/; Mounting Technology: Surface Mount; PartNumber: OPA4377AIPWR; Eco-Plan: Green (RoHS & no Sb/Br); ComponentLink3Description: Package Specification; ComponentLink2Description: Datasheet; DatasheetVersion: SBOS504B; ComponentLink1Description: Manufacturer URL; ComponentLink2URL: http://www.ti.com/general/docs/lit/getliterature.tsp?genericPartNumber=OPA4377&fileType=pdf; PackageVersion: 4040064-3/G, 02/2011
U10 = THS4552IPWT: Dual Channel, Low-Noise, Precision, 150-MHz, Fully Differential Amplifier 16-TSSOP -40 to 125; Manufacturer_Name: Texas Instruments; TYPE: TYPE; RefDes: RefDes; Copyright: Copyright (C) 2025 Ultra Librarian. All rights reserved.; Manufacturer_Part_Number: THS4552IPWT
U11 = ADS7054IRUGR: 14-Bit, 1MSPS, Differential Input, Small-Size Low-Power SAR ADC 8-X2QFN -40 to 125; Manufacturer_Name: Texas Instruments; TYPE: TYPE; RefDes: RefDes; Copyright: Copyright (C) 2026 Ultra Librarian. All rights reserved.; Manufacturer_Part_Number: ADS7054IRUGR

## Nets that join several sheets
+1.65V: MEHCP (DNP11.2), SENSE (7 pins)
+2.5V: MCU (R3.2), MEHCP (5 pins)
+3.3V: LOADS (8 pins), MCU (C6.1 C7.1 U3.2), POWER (5 pins), SENSE (16 pins)
+3.3V_SYS: MCU (7 pins), POWER (DNP13.1 JP8.2 R45.1 U14.1)
+5V: MCU (C11.1 U4.8), MEHCP (C16.1 U5.4 U6.4 U6.6), POWER (JP9.2 T21.1)
GND: LOADS (8 pins), MCU (23 pins), MEHCP (8 pins), POWER (26 pins), SENSE (18 pins)
V_GUARD: LOADS (J5.SHLD J6.SHLD), SENSE (C24.1 R22.2 T11.1)
NetC17_2: LOADS (U7.8), MEHCP (C17.2 D1.2 R14.2 T5.1)
NetC18_2: LOADS (U7.9), MEHCP (C18.2 D1.1 R15.1 T6.1)
NetD2_1: LOADS (U8.9), SENSE (D2.1 U9.3)
NetD2_2: LOADS (U8.8), SENSE (D2.2 U9.12)
NetJP5_1: LOADS (JP5.1), MCU (U1.1)
NetJP7_1: LOADS (JP7.1), MCU (U1.32)
NetR5_2: MCU (R5.2 R5.3 U4.1), MEHCP (RN1.1 RN1.4 T2.1)
NetR44_2: MCU (U1.12), POWER (R44.2 U14.3)
NetU1_26: MCU (U1.26), SENSE (U11.1)
NetU1_28: MCU (U1.28), SENSE (U11.2)
SPI1_SCK: MCU (U1.8 U3.7), SENSE (U11.3)